# EAGLE design motordriver_control_board_02 (EAGLE 6.5.0)
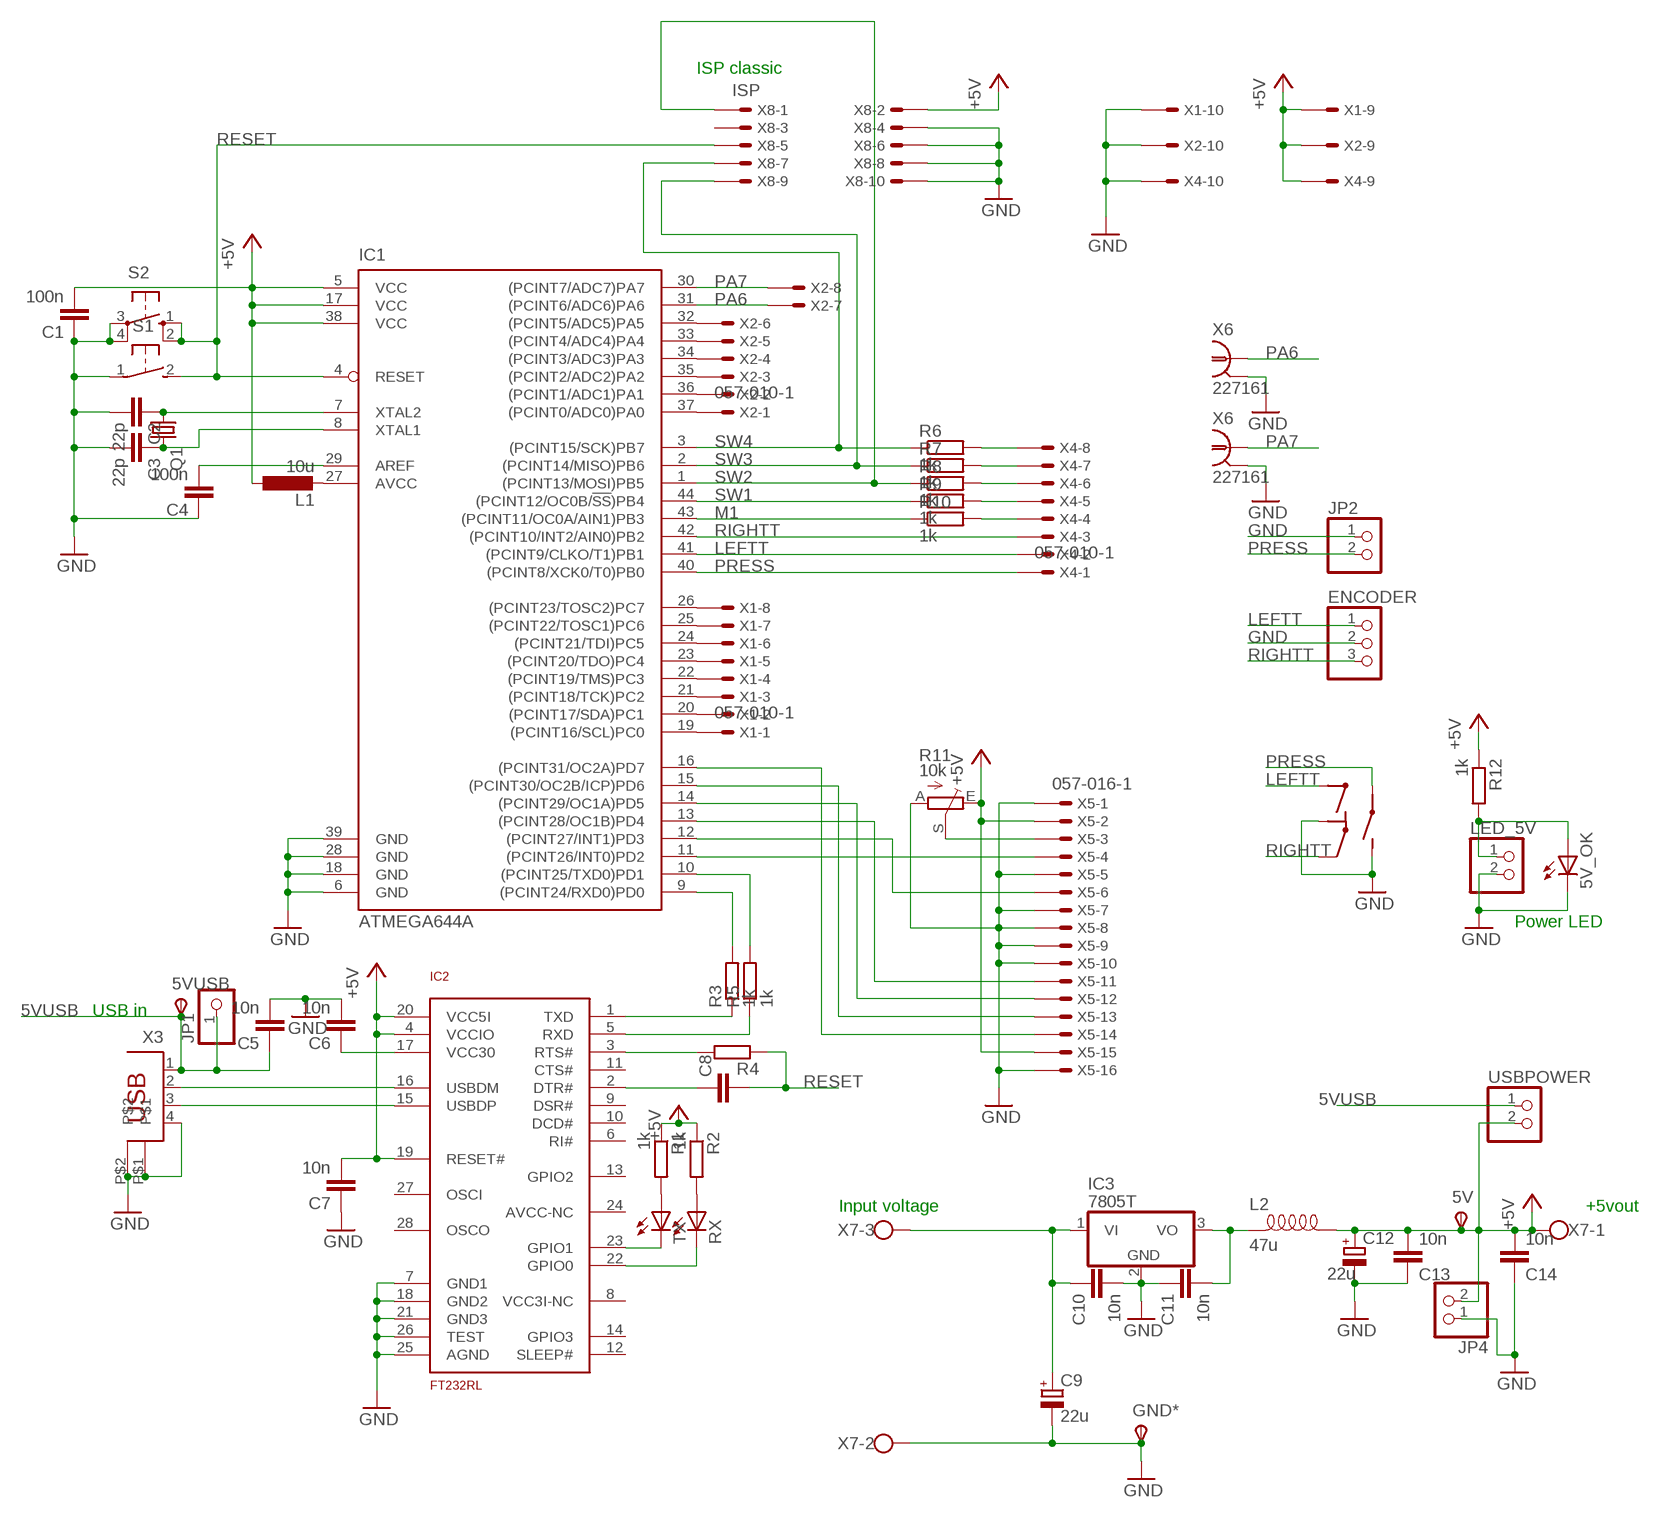
[diagram p0: schematic, sheet 1]

## Parts
5V  TPSPAD1-13  [P1-13]
5V_OK  ZURINO_LEDCHIP-LED0805  [ZURINO_CHIP-LED0805]
5VUSB  TPSPAD1-13  [P1-13]
C1  100n  C-EUC0805  [C0805]
C2  22p  C-EUC0805  [C0805]
C3  22p  C-EUC0805  [C0805]
C4  100n  C-EUC0805  [C0805]
C5  10n  C-EUC0805  [C0805]
C6  10n  C-EUC0805  [C0805]
C7  10n  C-EUC0805  [C0805]
C8  C-EUC0805  [C0805]
C9  22u  CPOL-EU153CLV-0605  [153CLV-0605]
C10  10n  C-EUC0805  [C0805]
C11  10n  C-EUC0805  [C0805]
C12  22u  CPOL-EU153CLV-0605  [153CLV-0605]
C13  10n  C-EUC0805  [C0805]
C14  10n  C-EUC0805  [C0805]
ENCODER  PINHD-1X3  [1X03]
GND*  TPSPAD1-13  [P1-13]
IC1  ATMEGA644A  [TQFP44]
IC2  FT232RL  SMARTPRJ_FT232RL  [SMARTPRJ_SSOP28]
IC3  7805T  [TO220H]
JP1  PINHD-1X1  [1X01]
JP2  PINHD-1X2  [1X02]
JP4  PINHD-1X2  [1X02]
L1  10u  L-EUL1812  [L1812]
L2  47u  A814AY-220M  [D10F]
LED_5V  PINHD-1X2  [1X02]
Q1  ZURINO_CRYSTALHC49UP  [ZURINO_HC49UP]
R1  1k  R-EU_M0805  [M0805]
R2  1k  R-EU_M0805  [M0805]
R3  1k  R-EU_M0805  [M0805]
R4  R-EU_M0805  [M0805]
R5  1k  R-EU_M0805  [M0805]
R6  1k  R-EU_M0805  [M0805]
R7  1k  R-EU_M0805  [M0805]
R8  1k  R-EU_M0805  [M0805]
R9  1k  R-EU_M0805  [M0805]
R10  1k  R-EU_M0805  [M0805]
R11  10k  TRIM_EU-B64Y  [B64Y]
R12  1k  R-EU_M0805  [M0805]
RX  ZURINO_LEDCHIP-LED0805  [ZURINO_CHIP-LED0805]
S1  ZURINO_31-XX  [ZURINO_OMRON_SW]
S2  10-XX  [B3F-10XX]
TX  ZURINO_LEDCHIP-LED0805  [ZURINO_CHIP-LED0805]
U$1  ENCODERW  [DREHENC]
USBPOWER  PINHD-1X2  [1X02]
X1  057-010-1  [057-010-1]
X2  057-010-1  [057-010-1]
X3  SMARTPRJ_PN61729  [SMARTPRJ_PN61729]
X4  057-010-1  [057-010-1]
X5  057-016-1  [057-016-1]
X6  227161  [AMP_227161]
X7  W237-103  [W237-103]
X8  ISP  057-010-1  [057-010-1]

## Nets
5VUSB: 5VUSB.TP(PP) C5.1 JP1.1 USBPOWER.1 X3.1
+5V: 5V.TP(PP) C1.2 C7.2 C12.+ C13.2 C14.2 IC1.5(VCC) IC1.17(VCC) IC1.38(VCC) IC2.4(VCCIO) IC2.19(RESET#) IC2.20(VCC5I) JP4.2 L1.1 L2.2 R1.1 R2.1 R11.E R12.1 USBPOWER.2 X1.9 X2.9 X4.9 X5.2 X5.15 X7.1 X8.2
GND: 5V_OK.C C1.1 C2.2 C3.2 C4.1 C5.2 C6.2 C7.1 C9.- C10.2 C11.1 C12.- C13.1 C14.1 ENCODER.2 GND*.TP(PP) IC1.6(GND) IC1.18(GND) IC1.28(GND) IC1.39(GND) IC2.7(GND1) IC2.18(GND2) IC2.21(GND3) IC2.25(AGND) IC2.26(TEST) IC3.2(GND) JP2.1 JP4.1 LED_5V.2 R11.A S1.1(P) S2.3(P) S2.4(P1) U$1.P$2 U$1.P$5 X1.10 X2.10 X3.4 X3.P$1 X3.P$2 X4.10 X5.1 X5.5 X5.7 X5.8 X5.9 X5.10 X5.16 X6.1_GND X6.2_GND X7.2 X8.4 X8.6 X8.8 X8.10
LEFTT: ENCODER.1 IC1.41((PCINT9/CLKO/T1)PB1) U$1.P$1 X4.2
M1: IC1.43((PCINT11/OC0A/AIN1)PB3) R10.1
N$1: IC1.19((PCINT16/SCL)PC0) X1.1
N$2: IC1.9((PCINT24/RXD0)PD0) R3.2
N$3: IC1.27(AVCC) L1.2
N$5: IC1.20((PCINT17/SDA)PC1) X1.2
N$6: C2.1 IC1.7(XTAL2) Q1.1
N$7: C3.1 IC1.8(XTAL1) Q1.2
N$8: C4.2 IC1.29(AREF)
N$9: IC1.10((PCINT25/TXD0)PD1) R5.2
N$10: IC2.1(TXD) R3.1
N$11: IC1.11((PCINT26/INT0)PD2) X5.4
N$12: R11.S X5.3
N$13: IC1.12((PCINT27/INT1)PD3) X5.6
N$14: IC1.21((PCINT18/TCK)PC2) X1.3
N$15: IC1.22((PCINT19/TMS)PC3) X1.4
N$16: IC1.23((PCINT20/TDO)PC4) X1.5
N$18: C9.+ C10.1 IC3.1(VI) X7.3
N$19: IC1.24((PCINT21/TDI)PC5) X1.6
N$20: IC2.5(RXD) R5.1
N$21: IC1.25((PCINT22/TOSC1)PC6) X1.7
N$22: IC1.26((PCINT23/TOSC2)PC7) X1.8
N$23: IC1.37((PCINT0/ADC0)PA0) X2.1
N$24: IC1.36((PCINT1/ADC1)PA1) X2.2
N$25: IC1.35((PCINT2/ADC2)PA2) X2.3
N$26: IC1.34((PCINT3/ADC3)PA3) X2.4
N$27: IC1.33((PCINT4/ADC4)PA4) X2.5
N$28: IC1.32((PCINT5/ADC5)PA5) X2.6
N$31: R10.2 X4.4
N$32: R9.2 X4.5
N$33: R8.2 X4.6
N$34: R7.2 X4.7
N$35: R6.2 X4.8
N$46: IC1.14((PCINT29/OC1A)PD5) X5.12
N$51: IC2.16(USBDM) X3.2
N$55: IC2.15(USBDP) X3.3
N$56: IC2.23(GPIO1) TX.C
N$59: IC2.22(GPIO0) RX.C
N$60: R2.2 RX.A
N$61: R1.2 TX.A
N$65: C6.1 IC2.17(VCC30)
N$69: C8.1 IC2.2(DTR#)
N$70: IC2.3(RTS#) R4.2
N$72: IC1.13((PCINT28/OC1B)PD4) X5.11
N$74: IC1.15((PCINT30/OC2B/ICP)PD6) X5.13
N$75: IC1.16((PCINT31/OC2A)PD7) X5.14
N$82: 5V_OK.A LED_5V.1 R12.2
N$101: C11.2 IC3.3(VO) L2.1
PA6: IC1.31((PCINT6/ADC6)PA6) X2.7 X6.1
PA7: IC1.30((PCINT7/ADC7)PA7) X2.8 X6.2
PRESS: IC1.40((PCINT8/XCK0/T0)PB0) JP2.2 U$1.P$4 X4.1
RESET: C8.2 IC1.4(RESET) R4.1 S1.2(S) S2.1(S) S2.2(S1) X8.5
RIGHTT: ENCODER.3 IC1.42((PCINT10/INT2/AIN0)PB2) U$1.P$3 X4.3
SW1: IC1.44((PCINT12/OC0B/!SS!)PB4) R9.1
SW2: IC1.1((PCINT13/MOSI)PB5) R8.1 X8.1
SW3: IC1.2((PCINT14/MISO)PB6) R7.1 X8.9
SW4: IC1.3((PCINT15/SCK)PB7) R6.1 X8.7
Unconnected: IC2.6(RI#) IC2.8(VCC3I-NC) IC2.9(DSR#) IC2.10(DCD#) IC2.11(CTS#) IC2.12(SLEEP#) IC2.13(GPIO2) IC2.14(GPIO3) IC2.24(AVCC-NC) IC2.27(OSCI) IC2.28(OSCO) X8.3

## Notes on the sheet
- ISP classic
- Power LED
- USB in
- Input voltage | +5vout

## Library data of the parts
5V 5VUSB GND* = testpad:TPS: TEST PIN
5V_OK RX TX = dcontrol:ZURINO_LED: LED
C1-C8 C10 C11 C13 C14 = rcl:C-EU: CAPACITOR, European symbol
C9 C12 = rcl:CPOL-EU: POLARIZED CAPACITOR, European symbol
ENCODER = pinhead:PINHD-1X3: PIN HEADER
IC1 = atmel:ATMEGA644: 8-bit Microcontroller with 64K Bytes In-System Programmable Flash Source: http://www.atmel.com/dyn/resources/prod_documents/doc2593.pdf; MPN: ATMEGA644PV-10AU; OC_FARNELL: 1455123; OC_NEWARK: 58M3748
IC2 = dcontrol:SMARTPRJ_FT232RL
IC3 = linear:78*: Positive VOLTAGE REGULATOR Source: http://cache.national.com/ds/LM/LM78L05.pdf http://www.fairchildsemi.com/ds/LM/LM7805.pdf
JP1 = pinhead:PINHD-1X1: PIN HEADER
JP2 JP4 LED_5V USBPOWER = pinhead:PINHD-1X2: PIN HEADER
L1 = rcl:L-EU: INDUCTOR, European symbol
L2 = inductor-toko:A814AY-220M: SMD 22µF Inductor Toko 2.00A 0.075ohm
Q1 = dcontrol:ZURINO_CRYSTAL: CRYSTAL
R1-R10 R12 = resistor:R-EU_: RESISTOR, European symbol
R11 = pot:TRIM_EU-: POTENTIOMETER
S1 = dcontrol:ZURINO_31-XX: OMRON SWITCH
S2 = switch-omron:10-XX: OMRON SWITCH; MPN: B3F-1000; OC_FARNELL: 176432; OC_NEWARK: 36M3542
U$1 = apd_driver_newformat_v9:ENCODERW
X1 X2 X4 X8 = con-panduit:057-010-: CONNECTOR 10-pin series 057 contact pc board low profile headers; OC_FARNELL: unknown; OC_NEWARK: unknown
X3 = arduino_2009:SMARTPRJ_PN61729: BERG USB connector
X5 = con-panduit:057-016-: CONNECTOR 10-pin series 057 contact pc board low profile headers; OC_FARNELL: unknown; OC_NEWARK: unknown
X6 = Kim:227161: JACK, RIGHT ANGLE, 50 OHM, PCB, BNC dual BNC Source: amp_227161.pdf
X7 = con-wago-500:W237-103: WAGO SCREW CLAMP; MPN: 237-103; OC_FARNELL: unknown; OC_NEWARK: 18M7116

## Board
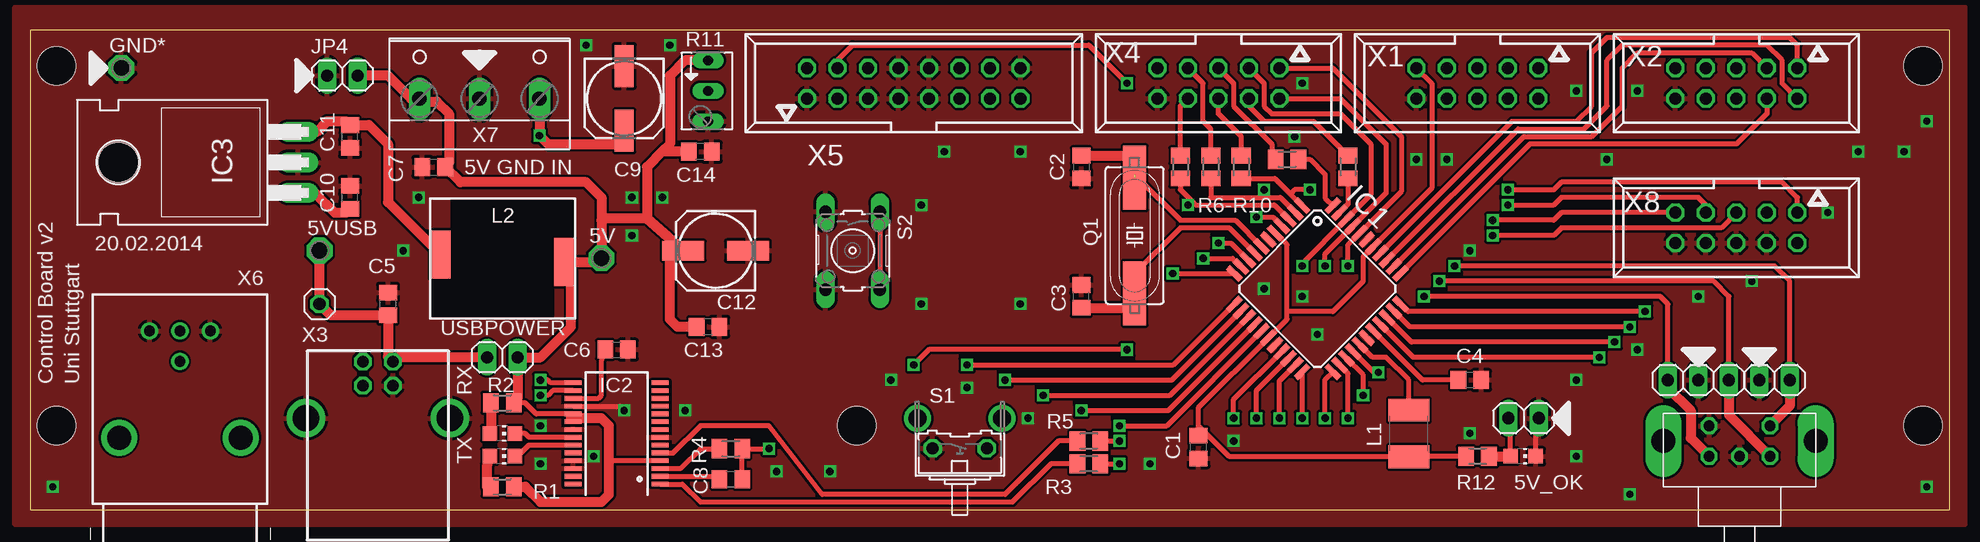
[diagram p1: board, top side]
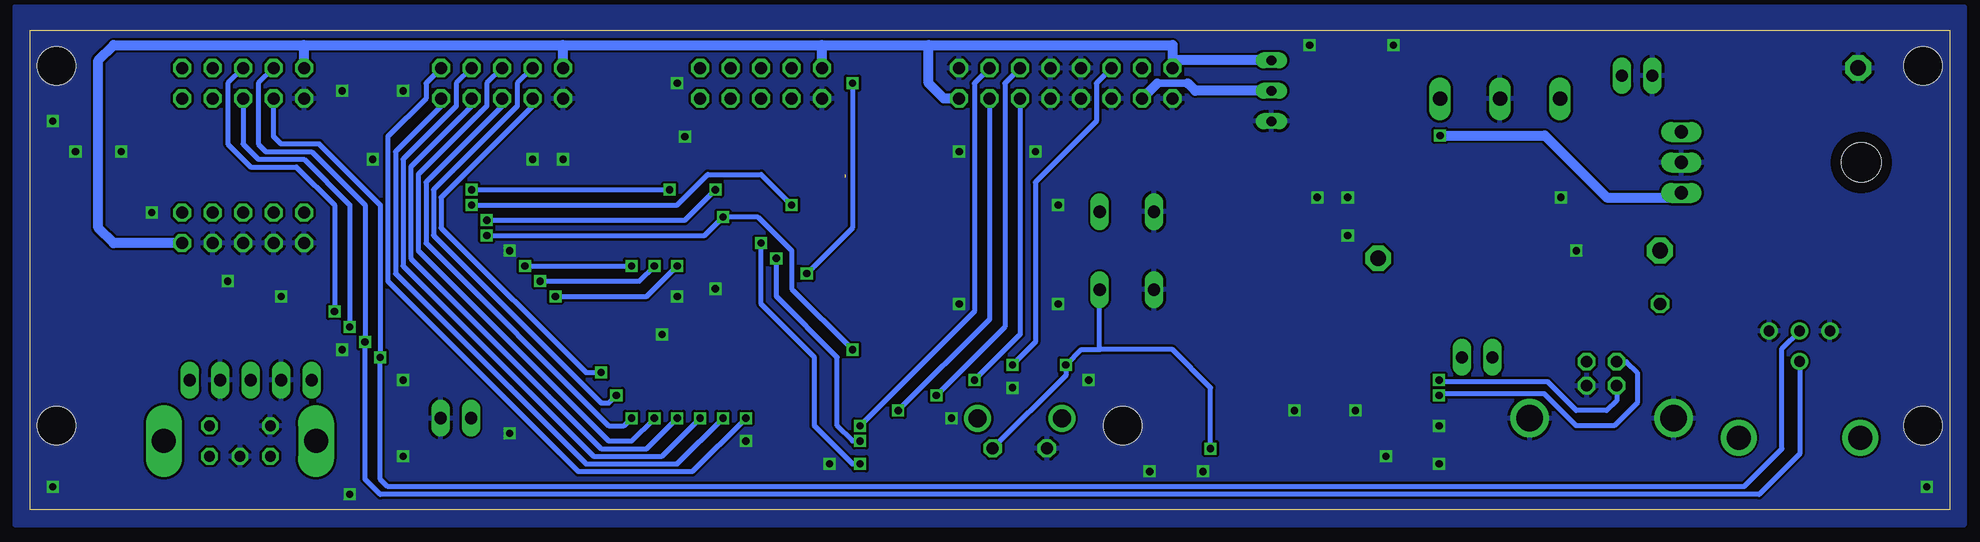
[diagram p2: board, bottom side, seen from below]

Size 160 x 40 mm. Coordinates in mm from the lower left corner, seen from the top.
Outline: 0,0 160,0 160,40 0,40 0,0
Copper layers (1*16): Top 0.035mm / dielectric 1.5mm / Bottom 0.035mm
Design rules "default *": minimum track width 12mil, minimum drill 20mil, track to track 8mil, track to pad 8mil, pad to pad 8mil, via to via 8mil, smd to smd 8mil, copper to edge 0mil, drill to drill 12mil, minimum pad ring 10mil, minimum via ring 8mil, stop-mask expansion 4mil, vias tented up to drill 0mil, thermal gap 10mil
Holes 3.2 mm at 2.2,7 2.2,37 157.8,37 157.8,7 68.9,7

### Footprints (pad centres in the part's own frame; a part is rotated, then mirrored left to right if it is on the bottom)
P1-13 = drill 1.321 pad 2.159 octagon: TP 0,0
ZURINO_CHIP-LED0805 = smd 1.2 x 1.2: A 0,-1.05; C 0,1.05
C0805 = smd 1.3 x 1.5: 1 -0.95,0; 2 0.95,0
153CLV-0605 = smd 3.5 x 1.6: + 2.7,0; - -2.7,0
1X03 = drill 1.016 long: 1 -2.54,0; 2 0,0; 3 2.54,0
TQFP44 = smd 1.5 x 0.5: 1 -5.8,4; 2 -5.8,3.2; 3 -5.8,2.4; 4 -5.8,1.6; 5 -5.8,0.8; 6 -5.8,0; 7 -5.8,-0.8; 8 -5.8,-1.6; 9 -5.8,-2.4; 10 -5.8,-3.2; 11 -5.8,-4; 23 5.8,-4; 24 5.8,-3.2; 25 5.8,-2.4; 26 5.8,-1.6; 27 5.8,-0.8; 28 5.8,0; 29 5.8,0.8; 30 5.8,1.6; 31 5.8,2.4; 32 5.8,3.2; 33 5.8,4 | smd 0.5 x 1.5: 12 -4,-5.8; 13 -3.2,-5.8; 14 -2.4,-5.8; 15 -1.6,-5.8; 16 -0.8,-5.8; 17 0,-5.8; 18 0.8,-5.8; 19 1.6,-5.8; 20 2.4,-5.8; 21 3.2,-5.8; 22 4,-5.8; 34 4,5.8; 35 3.2,5.8; 36 2.4,5.8; 37 1.6,5.8; 38 0.8,5.8; 39 0,5.8; 40 -0.8,5.8; 41 -1.6,5.8; 42 -2.4,5.8; 43 -3.2,5.8; 44 -4,5.8
SMARTPRJ_SSOP28 = smd 0.381 x 1.499: 1 -4.225,-3.625; 2 -3.575,-3.625; 3 -2.925,-3.625; 4 -2.275,-3.625; 5 -1.625,-3.625; 6 -0.975,-3.625; 7 -0.325,-3.625; 8 0.325,-3.625; 9 0.975,-3.625; 10 1.625,-3.625; 11 2.275,-3.625; 12 2.925,-3.625; 13 3.575,-3.625; 14 4.225,-3.625; 15 4.225,3.625; 16 3.575,3.625; 17 2.925,3.625; 18 2.275,3.625; 19 1.625,3.625; 20 0.975,3.625; 21 0.325,3.625; 22 -0.325,3.625; 23 -0.975,3.625; 24 -1.625,3.625; 25 -2.275,3.625; 26 -2.925,3.625; 27 -3.575,3.625; 28 -4.225,3.625
TO220H = drill 1.118 long: 1 -2.54,-10.16; 2 0,-10.16; 3 2.54,-10.16 | hole 3.302: 0,4.826
1X01 = drill 1.016 octagon: 1 0,0
1X02 = drill 1.016 long: 1 -1.27,0; 2 1.27,0
L1812 = smd 1.9 x 3.4: 1 -1.95,0; 2 1.95,0
D10F = smd 1.7 x 4: 1 -5.15,0.3; 2 5.15,-0.3
ZURINO_HC49UP = smd 5.334 x 1.93: 1 -4.826,0; 2 4.826,0
M0805 = smd 1.3 x 1.6: 1 -0.95,0; 2 0.95,0
B64Y = drill 0.813 long: A 2.54,0; E -2.54,0; S 0,0
ZURINO_OMRON_SW = drill 1.016 octagon: 1 -2.261,-1.245; 2 2.261,-1.245 | drill 1.499 pad 2.159: 3 -3.505,1.245; 4 3.505,1.245
B3F-10XX = drill 1.016 long: 1 -3.251,2.261; 2 3.251,2.261; 3 -3.251,-2.261; 4 3.251,-2.261
DREHENC = drill 0.9 octagon: P$1 -2.54,2.54; P$2 0,2.54; P$3 2.54,2.54; P$4 -2.54,0; P$5 2.54,0 | drill 2 long: P$6 6.35,1.27; P$7 -6.35,1.27
057-010-1 = drill 1 octagon: 1 -5.08,-1.27; 2 -5.08,1.27; 3 -2.54,-1.27; 4 -2.54,1.27; 5 0,-1.27; 6 0,1.27; 7 2.54,-1.27; 8 2.54,1.27; 9 5.08,-1.27; 10 5.08,1.27
SMARTPRJ_PN61729 = drill 0.95 octagon: 1 1.25,4.71; 2 -1.25,4.71; 3 -1.25,2.71; 4 1.25,2.71 | drill 2.2: P$1 -6,0; P$2 6,0
057-016-1 = drill 1 octagon: 1 -8.89,-1.27; 2 -8.89,1.27; 3 -6.35,-1.27; 4 -6.35,1.27; 5 -3.81,-1.27; 6 -3.81,1.27; 7 -1.27,-1.27; 8 -1.27,1.27; 9 1.27,-1.27; 10 1.27,1.27; 11 3.81,-1.27; 12 3.81,1.27; 13 6.35,-1.27; 14 6.35,1.27; 15 8.89,-1.27; 16 8.89,1.27
AMP_227161 = drill 0.9 pad 1.422: 1 0,-6.35; 1_GND -2.54,-8.89; 2 0,-8.89; 2_GND 2.54,-8.89 | drill 2: P$1 -5.08,0; P$2 5.08,0
W237-103 = drill 1.194 long: 1 -5,-1.29; 2 0,-1.29; 3 5,-1.29

### Placement (x,y rotation side)
5V  47.62,20.95 0 top
5V_OK  124.46,4.45 270 top
5VUSB  24.13,21.59 0 top
C1  97.41,5.21 90 top
C2  87.63,28.57 270 top
C3  87.63,17.78 90 top
C4  120.02,10.79 180 top
C5  29.84,17.14 90 top
C6  48.9,13.34 0 top
C7  33.66,28.57 0 top
C8  58.42,2.54 0 top
C9  49.53,34.29 270 top
C10  26.67,26.04 90 top
C11  26.67,31.11 90 top
C12  57.15,21.59 180 top
C13  56.52,15.24 180 top
C14  55.88,29.84 180 top
ENCODER  139.06,10.79 180 top
GND*  7.62,36.83 0 top
IC1  107.31,18.41 315 top
IC2  48.9,6.35 90 top
IC3  12.19,28.96 90 top
JP1  24.13,17.14 0 top
JP2  145.41,10.79 0 top
JP4  26.04,36.2 0 top
L1  114.94,6.35 90 top
L2  39.37,20.95 0 top
LED_5V  124.5,7.62 0 top
Q1  92.08,22.86 270 top
R1  39.37,1.91 180 top
R2  39.37,8.89 180 top
R3  88.27,3.81 0 top
R4  58.42,5.08 180 top
R5  88.27,5.71 0 top
R6  95.89,28.57 90 top
R7  98.42,28.57 90 top
R8  100.97,28.57 90 top
R9  104.78,29.21 180 top
R10  109.86,28.57 90 top
R11  56.52,34.92 270 top
R12  120.65,4.45 0 top
RX  39.37,6.35 270 top
S1  77.5,6.35 0 top
S2  68.58,21.59 270 top
TX  39.37,4.45 270 top
U$1  142.5,6.99 180 top
USBPOWER  39.37,12.7 0 top
X1  120.65,35.56 180 top
X2  142.24,35.56 180 top
X3  29,7.62 0 top
X4  99.06,35.56 180 top
X5  73.66,35.56 0 top
X6  12.5,6 180 top
X7  37.47,35.56 0 top
X8  142.24,23.5 180 top

### Tracks (layer width: path | path; a pad name or v marks a point on that pad's centre or on a via)
5VUSB
  Top 0.813: USBPOWER.1 30.62,12.7 X3.1 29.84,12.73 C5.1 25.08,16.2 JP1.1 5VUSB.TP
+5V
  Top 0.406: R2.1 41.27,8.89 42.19,7.97 IC2.19 45.09,7.79 45.09,7.62 45.09,7.51 IC2.20 | IC2.4 48.52,4.08 48.26,3.81 | C1.2 97.41,6.99 | 97.41,6.99 97.41,8.51 IC1.17 104.78,15.88 104.78,16.51 | R12.1 114.98,4.45 L1.1 99.99,4.4 97.41,6.99 | X1.9 116.84,35.56 116.84,26.81 IC1.38 111.12,21.09 111.12,19.05 108.58,16.51 104.78,16.51 | 104.78,16.51 104.78,22.09 IC1.5
  Top 0.813: JP4.2 29.84,36.2 31.77,34.27 X7.1 32.7,34.03 33.91,34.03 34.92,33.02 34.92,28.89 C7.2 35.88,27.3 46.35,27.3 47.62,26.04 47.62,24.13 | L2.2 45.09,20.66 | 45.09,20.66 47.33,20.66 5V.TP 47.62,24.13 | R1.1 41.27,1.91 42.55,0.64 47.62,0.64 48.26,1.27 48.26,3.81 48.26,6.99 47.62,7.62 45.09,7.62 | R2.1 40.64,9.21 USBPOWER.2 42.55,12.7 45.09,15.24 45.09,20.66 | R11.E 54.61,37.47 53.34,36.2 53.34,30.48 52.7,29.84 | 52.7,29.84 51.44,28.57 51.44,24.29 | 51.44,24.29 53.83,22.14 | 53.83,22.14 C12.+ | C14.2 52.7,29.84 | 51.44,24.29 47.78,24.29 47.62,24.13 | C13.2 53.98,15.24 53.34,15.88 53.34,21.65 53.83,22.14
  Bottom 0.813: X2.9 137.16,38.73 | 137.16,38.73 115.57,38.73 | X1.9 115.57,38.73 | 115.57,38.73 93.98,38.73 | X4.9 93.98,38.73 | 93.98,38.73 85.09,38.73 | 85.09,38.73 64.77,38.73 64.77,37.47 | 64.77,37.47 X5.2 | R11.E 64.77,37.47 | X8.2 153.03,22.23 154.31,23.5 154.31,37.47 153.03,38.73 137.16,38.73 | X5.15 83.82,34.29 85.09,35.56 85.09,38.73
GND  (via drill 0.6)
  Top 0.406: 5V_OK.C 125.51,7.4 LED_5V.2 | IC2.18 49.16,8.62 v49.53,8.26
  other vias: 74.3,25.4 76.2,29.84 82.55,29.84 82.55,17.14 78.11,10.16 83.19,7.62 93.34,3.81 107.31,14.61 102.87,18.41 120.02,21.59 131.44,29.21 118.11,29.21 115.57,29.21 106.05,35.56 149.86,24.77 143.51,19.05 139.06,17.78 133.99,13.34 128.91,10.79 133.35,1.27 128.91,4.45 120.02,6.35 100.33,5.71 71.75,10.79 62.23,3.17 42.55,3.81 1.91,1.91 158.12,1.91 158.12,32.38 152.4,29.84 156.21,29.84 128.91,34.92 133.99,34.92 106.05,17.78 50.16,22.86 50.16,26.04 52.7,26.04 46.35,38.73 31.11,21.59 32.38,26.04 53.34,38.73 74.3,17.14 105.41,31.11 54.61,8.26 46.99,4.45 42.55,6.99 66.67,3.17
  pour Bottom: -1.27,-1.27 -1.27,41.91 161.29,41.91 161.29,-1.27
  pour Top: -1.27,-1.27 -1.27,41.91 161.29,41.91 161.29,-1.27
LEFTT  (via drill 0.6)
  Top 0.406: X4.2 109.22,34.29 113.03,30.48 113.03,26.39 IC1.41 107.95,21.31 v107.95,20.32 | ENCODER.1 141.6,17.78 140.34,19.05 v117.47,19.05
  Top 0.813: ENCODER.1 141.6,7.88 U$1.P$1
  Bottom 0.406: v117.47,19.05 109.22,19.05 v107.95,20.32
M1
  Top 0.406: R10.1 109.86,25.48 IC1.43
N$1  (via drill 0.6)
  Top 0.406: v100.33,7.62 100.33,9.17 IC1.19
  Bottom 0.406: v100.33,7.62 104.78,3.17 114.3,3.17 130.18,19.05 130.18,31.11 127,34.29 127,35.56 X1.1
N$2  (via drill 0.6)
  Top 0.406: R3.2 v90.81,3.81 | v99.06,22.23 100.11,22.23 IC1.9
  Bottom 0.406: v90.81,3.81 91.44,3.81 94.61,6.99 94.61,12.7 99.06,17.14 v99.06,22.23
N$3
  Top 0.406: L1.2 114.94,10.79 113.03,12.7 111.9,12.7 IC1.27
N$5  (via drill 0.6)
  Top 0.406: v102.23,7.62 102.23,9.94 IC1.20
  Bottom 0.406: X1.2 125.73,33.66 129.54,29.84 129.54,19.68 113.67,3.81 106.05,3.81 v102.23,7.62
N$6  (1 unrouted)
  Top 0.406: Q1.1 92.33,27.69 95.89,24.13 100.47,24.13 IC1.7
  Top 0.813: C2.1 91.76,29.52 92.08,29.21 92.08,27.94
N$7
  Top 0.406: Q1.2 92.08,19.68 95.89,23.5 99.97,23.5 IC1.8
  Top 0.813: C3.1 91.75,16.83 92.08,16.51 Q1.2
N$8
  Top 0.406: C4.2 116.07,10.79 IC1.29
N$9  (via drill 0.6)
  Top 0.406: R5.2 v90.81,5.71 | v97.79,20.95 100.25,20.95 IC1.10
  Bottom 0.406: v90.81,5.71 91.44,5.71 92.71,6.99 92.71,12.7 97.79,17.78 v97.79,20.95
N$10
  Top 0.406: IC2.1 54.39,2.12 55.88,0.64 81.92,0.64 85.09,3.81 R3.1
N$11  (via drill 0.6)
  Top 0.406: X5.4 67.31,37.47 68.58,38.73 88.27,38.73 v91.44,35.56 | v95.25,19.68 IC1.11
  Bottom 0.406: v91.44,35.56 91.44,23.5 v95.25,19.68
N$12
  Bottom 0.61: 63.5,35.56 66.04,35.56
  Bottom 0.813: R11.S 62.87,34.92 63.5,35.56 | 66.04,35.56 X5.3
N$13  (via drill 0.6)
  Top 0.406: v78.11,12.06 95.31,12.06 IC1.12
  Bottom 0.406: X5.6 71.12,35.56 71.12,32.38 76.2,27.3 76.2,13.97 v78.11,12.06
N$14  (via drill 0.6)
  Top 0.406: v104.14,7.62 104.14,10.71 IC1.21
  Bottom 0.406: X1.3 124.46,35.56 124.46,33.66 128.91,29.21 128.91,20.32 113.03,4.45 107.31,4.45 v104.14,7.62
N$15  (via drill 0.6)
  Top 0.406: v106.05,7.62 IC1.22
  Bottom 0.406: X1.4 123.19,33.66 128.27,28.57 128.27,20.95 112.39,5.08 108.58,5.08 v106.05,7.62
N$16  (via drill 0.6)
  Top 0.406: v107.95,7.62 107.95,10.85 IC1.23
  Bottom 0.406: X1.5 121.92,35.56 121.92,33.66 127.64,27.94 127.64,21.59 111.76,5.71 109.86,5.71 v107.95,7.62
N$18  (via drill 0.6)
  Top 0.813: X7.3 v42.47,31.2 43.18,30.48 49.53,30.48 C9.+ | IC3.1 23.75,26.42 25.4,24.77 26.35,24.77 C10.1
  Bottom 0.813: v42.47,31.2 33.73,31.2 28.57,26.04 22.73,26.04 IC3.1
N$19  (via drill 0.6)
  Top 0.406: v109.86,7.62 109.86,11.35 IC1.24
  Bottom 0.406: X1.6 120.65,33.66 127,27.3 127,22.23 111.76,6.99 110.49,6.99 v109.86,7.62
N$20
  Top 0.406: IC2.5 53.62,4.72 55.88,6.99 61.59,6.99 66.04,1.27 81.28,1.27 85.72,5.71 R5.1
N$21  (via drill 0.6)
  Top 0.406: v111.12,9.53 111.12,11.21 IC1.25
  Bottom 0.406: X1.7 119.38,35.56 119.38,33.66 126.36,26.67 126.36,22.86 112.39,8.89 111.76,8.89 v111.12,9.53
N$22  (via drill 0.6)
  Top 0.406: v112.39,11.43 112.04,11.43 IC1.26
  Bottom 0.406: X1.8 118.11,33.66 125.73,26.04 125.73,23.5 113.67,11.43 v112.39,11.43
N$23
  Top 0.406: X2.1 147.32,38.73 146.69,39.37 131.44,39.37 130.18,38.1 130.18,33.66 128.91,32.38 123.55,32.38 IC1.37
N$24
  Top 0.406: X2.2 146.05,35.56 146.05,37.47 144.78,38.73 132.72,38.73 131.44,37.47 131.44,33.66 129.54,31.75 124.04,31.75 IC1.36
N$25
  Top 0.406: IC1.35 124.54,31.11 130.18,31.11 132.72,33.66 132.72,36.83 133.99,38.1 143.51,38.1 X2.3
N$26
  Top 0.406: X2.4 144.78,33.02 142.24,30.48 125.04,30.48 IC1.34
N$27  (via drill 0.6)
  Top 0.406: v134.62,16.51 114.88,16.51 IC1.33
  Bottom 0.406: X2.5 143.51,35.56 143.51,30.48 141.6,28.57 137.79,28.57 134.62,25.4 v134.62,16.51
N$28  (via drill 0.6)
  Top 0.406: v133.35,15.24 115.02,15.24 IC1.32
  Bottom 0.406: X2.6 142.24,30.48 140.97,29.21 137.16,29.21 133.35,25.4 v133.35,15.24
N$31
  Top 0.406: X4.4 101.6,33.66 102.87,32.38 107,32.38 R10.2
N$32
  Top 0.406: X4.5 100.33,35.56 100.33,33.66 103.5,30.48 103.5,29.53 R9.2
N$33
  Top 0.406: X4.6 99.06,33.02 100.97,31.11 R8.2
N$34
  Top 0.406: R7.2 98.42,31.75 97.79,32.38 97.79,35.56 X4.7
N$35
  Top 0.406: R6.2 95.89,33.66 X4.8
N$46  (via drill 0.6)
  Top 0.406: v84.45,9.53 95.03,9.53 IC1.14
  Bottom 0.406: X5.12 78.74,35.56 78.74,15.24 v84.45,9.53
N$51  (via drill 0.6)
  Top 0.406: IC2.16 43.58,9.93 43.18,9.53 v42.55,9.53
  Bottom 0.406: v42.55,9.53 42.42,9.65 33.78,9.65 31.11,6.99 27.94,6.99 26.04,8.89 26.04,11.43 26.93,12.33 X3.2
N$55  (via drill 0.6)
  Top 0.406: IC2.15 43.4,10.57 43.18,10.79 v42.55,10.79
  Bottom 0.406: v42.55,10.79 42.42,10.67 33.53,10.67 31.11,8.26 28.57,8.26 27.75,9.08 X3.3
N$56
  Top 0.406: IC2.23 41.57,5.38 40.64,4.45 TX.C
N$59
  Top 0.406: IC2.22 41.6,6.03 41.27,6.35 RX.C
N$60
  Top 0.813: R2.2 38.42,6.45 RX.A
N$61
  Top 0.813: R1.2 38.1,1.91 38.1,3.59 TX.A
N$65
  Top 0.406: IC2.17 47.38,9.28 47.62,9.53 47.62,12.38 C6.1
N$69
  Top 0.406: IC2.2 57.23,2.77 C8.1
N$70
  Top 0.406: IC2.3 54.23,3.42 55.88,5.08 R4.2
N$72  (via drill 0.6)
  Top 0.406: v81.28,10.79 95.17,10.79 IC1.13
  Bottom 0.406: X5.11 77.47,14.61 v81.28,10.79
N$74  (via drill 0.6)
  Top 0.406: v87.63,8.26 94.89,8.26 IC1.15
  Bottom 0.406: X5.13 80.01,15.88 v87.63,8.26
N$75  (via drill 0.6)
  Top 0.406: v90.81,6.99 94.75,6.99 IC1.16
  Bottom 0.406: X5.14 81.28,35.56 81.28,16.51 v90.81,6.99
N$82
  Top 0.406: 5V_OK.A 123.41,7.4 LED_5V.1
  Top 0.813: R12.2 5V_OK.A
N$101
  Top 0.813: IC3.3 23.88,31.5 24.77,32.38 26.35,32.38 C11.2 28.26,32.06 29.84,30.48 29.84,25.63 L2.1
PA6  (via drill 0.6)
  Top 0.406: v132.08,13.97 115.15,13.97 IC1.31
  Bottom 0.406: X2.7 140.97,35.56 140.97,30.48 140.34,29.84 136.53,29.84 132.08,25.4 v132.08,13.97 132.08,2.54 130.81,1.27 15.88,1.27 12.5,4.64 X6.1
PA7  (via drill 0.6)
  Top 0.406: v130.81,12.7 115.29,12.7 IC1.30
  Bottom 0.406: X2.8 139.7,31.11 139.06,30.48 135.89,30.48 130.81,25.4 v130.81,12.7 130.81,2.54 130.18,1.91 17.14,1.91 13.97,5.08 13.97,13.42 X6.2
PRESS  (via drill 0.6)
  Top 0.406: X4.1 108.58,36.83 114.3,31.11 114.3,26.53 IC1.40 109.86,22.09 v109.86,20.32 | JP2.2 146.69,19.05 145.41,20.32 v118.75,20.32
  Top 0.813: JP2.2 146.69,8.63 U$1.P$4
  Bottom 0.406: v118.75,20.32 v109.86,20.32
RESET  (via drill 0.6)
  Top 0.406: X8.5 140.97,23.5 127.64,23.5 127,22.86 v121.92,22.86 | C8.2 R4.1 v61.59,5.08 | v91.44,13.34 74.93,13.34 v73.66,12.06 | S2.1 S2.2 | v102.23,24.38 103.61,24.38 IC1.4
  Bottom 0.406: v91.44,13.34 96.52,18.41 96.52,21.59 99.31,24.38 v102.23,24.38 103.76,22.86 v121.92,22.86 | v61.59,5.08 61.59,10.16 64.77,13.34 70.84,13.34 | S1.2 73.66,11.18 v73.66,12.06 72.39,13.34 70.84,13.34 | 70.84,13.34 S2.2
RIGHTT  (via drill 0.6)
  Top 0.406: X4.3 102.87,35.56 102.87,33.66 103.5,33.02 109.22,33.02 111.76,30.48 111.76,26.25 IC1.42 106.05,20.54 v106.05,20.32 | ENCODER.3 136.53,17.14 135.89,17.78 v116.2,17.78
  Top 0.813: ENCODER.3 136.53,10.16 138.43,8.26 138.43,5.97 U$1.P$3
  Bottom 0.406: v116.2,17.78 108.58,17.78 v106.05,20.32
SW1
  Top 0.406: R9.1 106.68,29.21 107.95,27.94 107.95,25.98 IC1.44
SW2  (via drill 0.6)
  Top 0.406: R8.1 103.76,27.62 105.06,26.32 | 105.06,26.32 IC1.1 | X8.1 147.32,26.04 146.05,27.3 127.64,27.3 127,26.67 v123.19,26.67 | v106.68,26.67 105.41,26.67 105.06,26.32
  Bottom 0.406: v123.19,26.67 v106.68,26.67
SW3  (via drill 0.6)
  Top 0.406: R7.1 98.42,26.04 102.87,26.04 | 102.87,26.04 104.22,26.04 IC1.2 | v102.87,26.67 102.87,26.04 | X8.9 127.64,24.77 127,24.13 v121.92,24.13
  Bottom 0.406: v121.92,24.13 105.41,24.13 v102.87,26.67
SW4  (via drill 0.6)
  Top 0.406: R6.1 95.89,26.67 96.84,25.72 | 96.84,25.72 97.16,25.4 103.72,25.4 IC1.3 | X8.7 139.7,25.4 139.06,26.04 127.64,26.04 127,25.4 v123.19,25.4 | v96.52,25.4 96.84,25.72
  Bottom 0.406: v123.19,25.4 106.05,25.4 103.5,27.94 99.06,27.94 v96.52,25.4

### Text on the board
tPlace: 5V GND IN
tNames: R6-R10 | 20.02.2014 | Control Board v2 | Uni Stuttgart